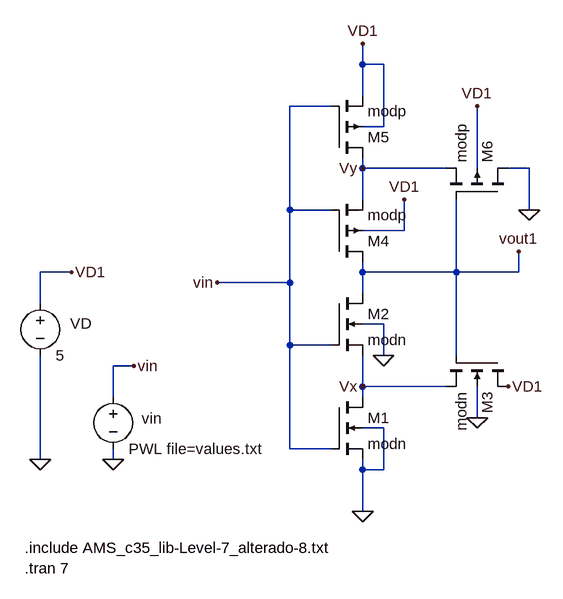
[diagram p0: schematic Schmitt-trigger-complete.asc]
Schmitt-trigger-complete.asc, the LTspice schematic file:
Version 4
SHEET 1 175388 1188
WIRE -816 -96 -816 -128
WIRE -784 -96 -816 -96
WIRE -816 -48 -816 -96
WIRE -864 -32 -928 -32
WIRE -784 0 -784 -96
WIRE -784 0 -816 0
WIRE -816 64 -816 48
WIRE -688 64 -816 64
WIRE -640 64 -640 -32
WIRE -560 64 -592 64
WIRE -816 112 -816 64
WIRE -928 128 -928 -32
WIRE -864 128 -928 128
WIRE -560 128 -560 64
WIRE -752 160 -752 112
WIRE -752 160 -816 160
WIRE -1264 224 -1312 224
WIRE -816 224 -816 208
WIRE -672 224 -672 112
WIRE -672 224 -816 224
WIRE -576 224 -576 192
WIRE -576 224 -672 224
WIRE -928 240 -928 128
WIRE -928 240 -1040 240
WIRE -816 256 -816 224
WIRE -1312 272 -1312 224
WIRE -784 304 -816 304
WIRE -928 336 -928 240
WIRE -864 336 -928 336
WIRE -784 352 -784 304
WIRE -672 352 -672 224
WIRE -1168 368 -1200 368
WIRE -816 400 -816 352
WIRE -688 400 -816 400
WIRE -1200 416 -1200 368
WIRE -816 416 -816 400
WIRE -640 448 -640 400
WIRE -784 464 -816 464
WIRE -928 496 -928 336
WIRE -864 496 -928 496
WIRE -1312 512 -1312 352
WIRE -1200 512 -1200 496
WIRE -816 528 -816 512
WIRE -784 528 -784 464
WIRE -784 528 -816 528
WIRE -816 592 -816 528
FLAG -1312 512 0
FLAG -1264 224 VD1
FLAG -1200 512 0
FLAG -1168 368 vin
FLAG -816 592 0
FLAG -784 352 0
FLAG -640 448 0
FLAG -592 400 VD1
FLAG -816 400 Vx
FLAG -576 192 vout1
FLAG -816 -128 VD1
FLAG -560 128 0
FLAG -640 -32 VD1
FLAG -752 112 VD1
FLAG -1040 240 vin
FLAG -816 64 Vy
SYMBOL voltage -1312 256 R0
WINDOW 0 46 47 Left 2
WINDOW 123 0 0 Left 2
WINDOW 39 0 0 Left 2
SYMATTR InstName VD
SYMATTR Value 5
SYMBOL voltage -1200 400 R0
WINDOW 0 44 49 Left 2
WINDOW 123 0 0 Left 2
WINDOW 39 0 0 Left 2
SYMATTR InstName vin
SYMATTR Value PWL file=values.txt
SYMBOL nmos4 -864 416 R0
SYMATTR InstName M1
SYMATTR Value modn
SYMATTR Value2 l=2.4u w=2.4u
SYMBOL nmos4 -864 256 R0
SYMATTR InstName M2
SYMATTR Value modn
SYMATTR Value2 l=2.4u w=2.4u
SYMBOL nmos4 -592 352 R90
SYMATTR InstName M3
SYMATTR Value modn
SYMATTR Value2 l=2.8u w=6.6u
SYMBOL pmos4 -864 208 M180
SYMATTR InstName M4
SYMATTR Value modp
SYMATTR Value2 l=1.2u w=4.8u
SYMBOL pmos4 -864 48 M180
SYMATTR InstName M5
SYMATTR Value modp
SYMATTR Value2 l=1.2u w=4.8u
SYMBOL pmos4 -592 112 M270
SYMATTR InstName M6
SYMATTR Value modp
SYMATTR Value2 l=1.2u w=10.8u
TEXT -1336 648 Left 2 !.include AMS_c35_lib-Level-7_alterado-8.txt
TEXT -1336 680 Left 2 !.tran 7

The netlist it stands for:
* Schmitt-trigger-complete.asc
VD VD1 0 5
vin vin 0 PWL file=values.txt
M1 Vx vin 0 0 modn l=2.4u w=2.4u
M2 vout1 vin Vx 0 modn l=2.4u w=2.4u
M3 VD1 vout1 Vx 0 modn l=2.8u w=6.6u
M4 vout1 vin Vy VD1 modp l=1.2u w=4.8u
M5 Vy vin VD1 VD1 modp l=1.2u w=4.8u
M6 0 vout1 Vy VD1 modp l=1.2u w=10.8u
.model NMOS NMOS
.model PMOS PMOS
.lib standard.mos
.include AMS_c35_lib-Level-7_alterado-8.txt
.tran 7
.backanno
.end